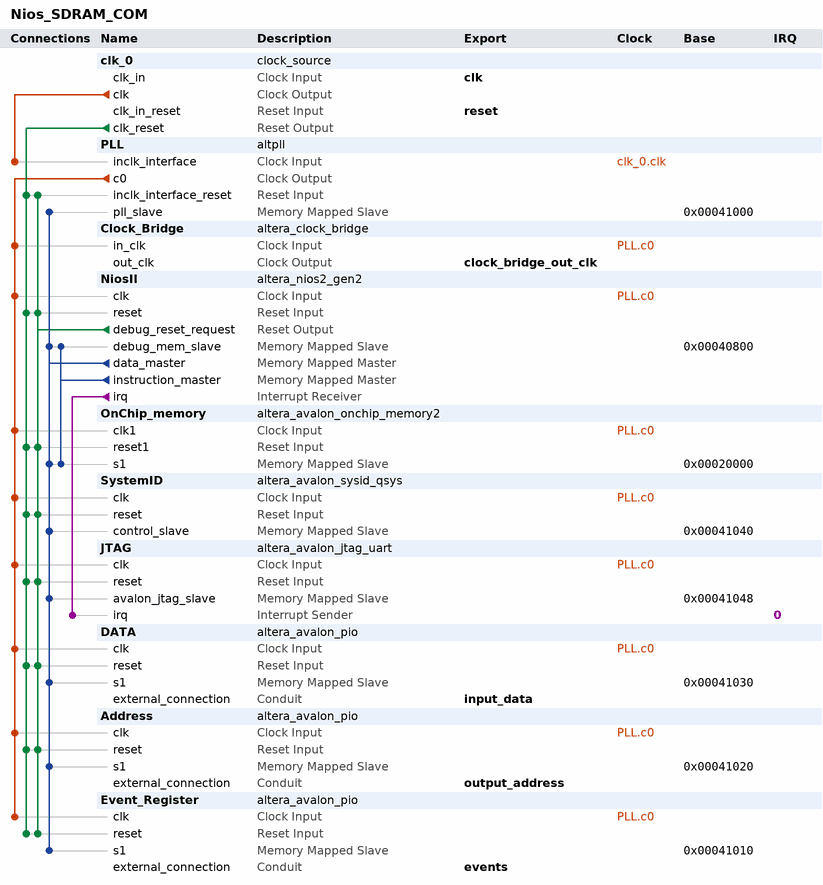
[diagram p0: system contents]
# Platform Designer (Qsys) system Nios_SDRAM_COM, Cyclone IV E EP4CE115F29C7
# Parameters at their usual value, and those the tool derives, are not listed.
package require -exact qsys 18.0
create_system Nios_SDRAM_COM
set_project_property DEVICE_FAMILY {Cyclone IV E}
set_project_property DEVICE EP4CE115F29C7

add_instance clk_0 clock_source 18.0
set_instance_parameter_value clk_0 clockFrequency 50000000

add_instance PLL altpll 18.0
set_instance_parameter_value PLL CLK0_DIVIDE_BY 1
set_instance_parameter_value PLL CLK0_MULTIPLY_BY 2
set_instance_parameter_value PLL INCLK0_INPUT_FREQUENCY 20000
set_instance_parameter_value PLL PORT_ARESET PORT_UNUSED
set_instance_parameter_value PLL PORT_LOCKED PORT_UNUSED
set_instance_parameter_value PLL PORT_clk1 PORT_UNUSED
set_instance_parameter_value PLL PORT_clk2 PORT_UNUSED
set_instance_parameter_value PLL PORT_clk3 PORT_UNUSED

add_instance Clock_Bridge altera_clock_bridge 18.0
set_instance_parameter_value Clock_Bridge DERIVED_CLOCK_RATE 100000000
set_instance_parameter_value Clock_Bridge EXPLICIT_CLOCK_RATE 0

add_instance NiosII altera_nios2_gen2 18.0
set_instance_parameter_value NiosII dcache_size 2048
set_instance_parameter_value NiosII exceptionSlave OnChip_memory.s1
set_instance_parameter_value NiosII icache_size 4096
set_instance_parameter_value NiosII impl Fast
set_instance_parameter_value NiosII resetSlave OnChip_memory.s1

add_instance OnChip_memory altera_avalon_onchip_memory2 18.0
set_instance_parameter_value OnChip_memory dataWidth 32
set_instance_parameter_value OnChip_memory dualPort false
set_instance_parameter_value OnChip_memory initMemContent true
set_instance_parameter_value OnChip_memory initializationFileName onchip_mem.hex
set_instance_parameter_value OnChip_memory memorySize 100000

add_instance SystemID altera_avalon_sysid_qsys 18.0
set_instance_parameter_value SystemID id 0

add_instance JTAG altera_avalon_jtag_uart 18.0
set_instance_parameter_value JTAG simInteractiveOptions NO_INTERACTIVE_WINDOWS

add_instance DATA altera_avalon_pio 18.0
set_instance_parameter_value DATA direction Input
set_instance_parameter_value DATA width 16

add_instance Address altera_avalon_pio 18.0
set_instance_parameter_value Address direction Output
set_instance_parameter_value Address width 20

add_instance Event_Register altera_avalon_pio 18.0
set_instance_parameter_value Event_Register direction Input
set_instance_parameter_value Event_Register width 3

# connections
add_connection clk_0.clk PLL.inclk_interface clock
add_connection PLL.c0 Address.clk clock
add_connection PLL.c0 Clock_Bridge.in_clk clock
add_connection PLL.c0 DATA.clk clock
add_connection PLL.c0 Event_Register.clk clock
add_connection PLL.c0 JTAG.clk clock
add_connection PLL.c0 NiosII.clk clock
add_connection PLL.c0 OnChip_memory.clk1 clock
add_connection PLL.c0 SystemID.clk clock
add_connection clk_0.clk_reset Address.reset reset
add_connection clk_0.clk_reset DATA.reset reset
add_connection clk_0.clk_reset Event_Register.reset reset
add_connection clk_0.clk_reset JTAG.reset reset
add_connection clk_0.clk_reset NiosII.reset reset
add_connection clk_0.clk_reset OnChip_memory.reset1 reset
add_connection clk_0.clk_reset PLL.inclk_interface_reset reset
add_connection clk_0.clk_reset SystemID.reset reset
add_connection NiosII.debug_reset_request Address.reset reset
add_connection NiosII.debug_reset_request DATA.reset reset
add_connection NiosII.debug_reset_request Event_Register.reset reset
add_connection NiosII.debug_reset_request JTAG.reset reset
add_connection NiosII.debug_reset_request NiosII.reset reset
add_connection NiosII.debug_reset_request OnChip_memory.reset1 reset
add_connection NiosII.debug_reset_request PLL.inclk_interface_reset reset
add_connection NiosII.debug_reset_request SystemID.reset reset
add_connection NiosII.data_master Address.s1 avalon
set_connection_parameter_value NiosII.data_master/Address.s1 baseAddress 0x00041020
add_connection NiosII.data_master DATA.s1 avalon
set_connection_parameter_value NiosII.data_master/DATA.s1 baseAddress 0x00041030
add_connection NiosII.data_master Event_Register.s1 avalon
set_connection_parameter_value NiosII.data_master/Event_Register.s1 baseAddress 0x00041010
add_connection NiosII.data_master JTAG.avalon_jtag_slave avalon
set_connection_parameter_value NiosII.data_master/JTAG.avalon_jtag_slave baseAddress 0x00041048
add_connection NiosII.data_master NiosII.debug_mem_slave avalon
set_connection_parameter_value NiosII.data_master/NiosII.debug_mem_slave baseAddress 0x00040800
add_connection NiosII.data_master OnChip_memory.s1 avalon
set_connection_parameter_value NiosII.data_master/OnChip_memory.s1 baseAddress 0x00020000
add_connection NiosII.data_master PLL.pll_slave avalon
set_connection_parameter_value NiosII.data_master/PLL.pll_slave baseAddress 0x00041000
add_connection NiosII.data_master SystemID.control_slave avalon
set_connection_parameter_value NiosII.data_master/SystemID.control_slave baseAddress 0x00041040
add_connection NiosII.instruction_master NiosII.debug_mem_slave avalon
set_connection_parameter_value NiosII.instruction_master/NiosII.debug_mem_slave baseAddress 0x00040800
add_connection NiosII.instruction_master OnChip_memory.s1 avalon
set_connection_parameter_value NiosII.instruction_master/OnChip_memory.s1 baseAddress 0x00020000
add_connection NiosII.irq JTAG.irq interrupt
set_connection_parameter_value NiosII.irq/JTAG.irq irqNumber 0

# exported interfaces
add_interface clk clock sink
set_interface_property clk EXPORT_OF clk_0.clk_in
add_interface clock_bridge_out_clk clock source
set_interface_property clock_bridge_out_clk EXPORT_OF Clock_Bridge.out_clk
add_interface events conduit end
set_interface_property events EXPORT_OF Event_Register.external_connection
add_interface input_data conduit end
set_interface_property input_data EXPORT_OF DATA.external_connection
add_interface output_address conduit end
set_interface_property output_address EXPORT_OF Address.external_connection
add_interface reset reset sink
set_interface_property reset EXPORT_OF clk_0.clk_in_reset

set_interconnect_requirement {$system} qsys_mm.clockCrossingAdapter HANDSHAKE
set_interconnect_requirement {$system} qsys_mm.enableEccProtection FALSE
set_interconnect_requirement {$system} qsys_mm.insertDefaultSlave FALSE
set_interconnect_requirement {$system} qsys_mm.maxAdditionalLatency 1

save_system Nios_SDRAM_COM.qsys
